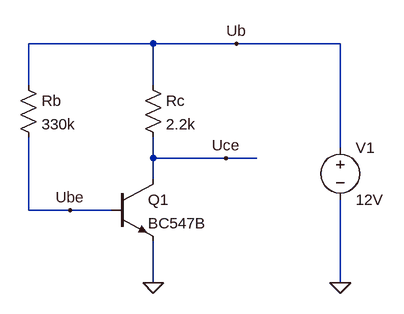
[diagram p0: schematic AP_Stab_BasisRv.asc]
AP_Stab_BasisRv.asc, the LTspice schematic file:
Version 4
SHEET 1 880 680
WIRE 288 48 96 48
WIRE 416 48 288 48
WIRE 576 48 416 48
WIRE 96 112 96 48
WIRE 288 112 288 48
WIRE 576 208 576 48
WIRE 288 224 288 192
WIRE 400 224 288 224
WIRE 448 224 400 224
WIRE 288 256 288 224
WIRE 96 304 96 192
WIRE 160 304 96 304
WIRE 224 304 160 304
WIRE 288 416 288 352
WIRE 576 416 576 288
FLAG 288 416 0
FLAG 576 416 0
FLAG 416 48 Ub
FLAG 160 304 Ube
FLAG 400 224 Uce
SYMBOL res 80 96 R0
SYMATTR InstName Rb
SYMATTR Value 330k
SYMBOL res 272 96 R0
SYMATTR InstName Rc
SYMATTR Value 2.2k
SYMBOL voltage 576 192 R0
WINDOW 123 0 0 Left 2
WINDOW 39 0 0 Left 2
SYMATTR InstName V1
SYMATTR Value 12V
SYMBOL npn 224 256 R0
SYMATTR InstName Q1
SYMATTR Value BC547B

The netlist it stands for:
* AP_Stab_BasisRv.asc
Rb Ub Ube 330k
Rc Ub Uce 2.2k
V1 Ub 0 12V
Q1 Uce Ube 0 0 BC547B
.model NPN NPN
.model PNP PNP
.lib standard.bjt
.backanno
.end